# Altium schematic sheet _Power_Rail_Probe.SchDoc
size A2; SheetNumber: 1; SheetTotal: 1
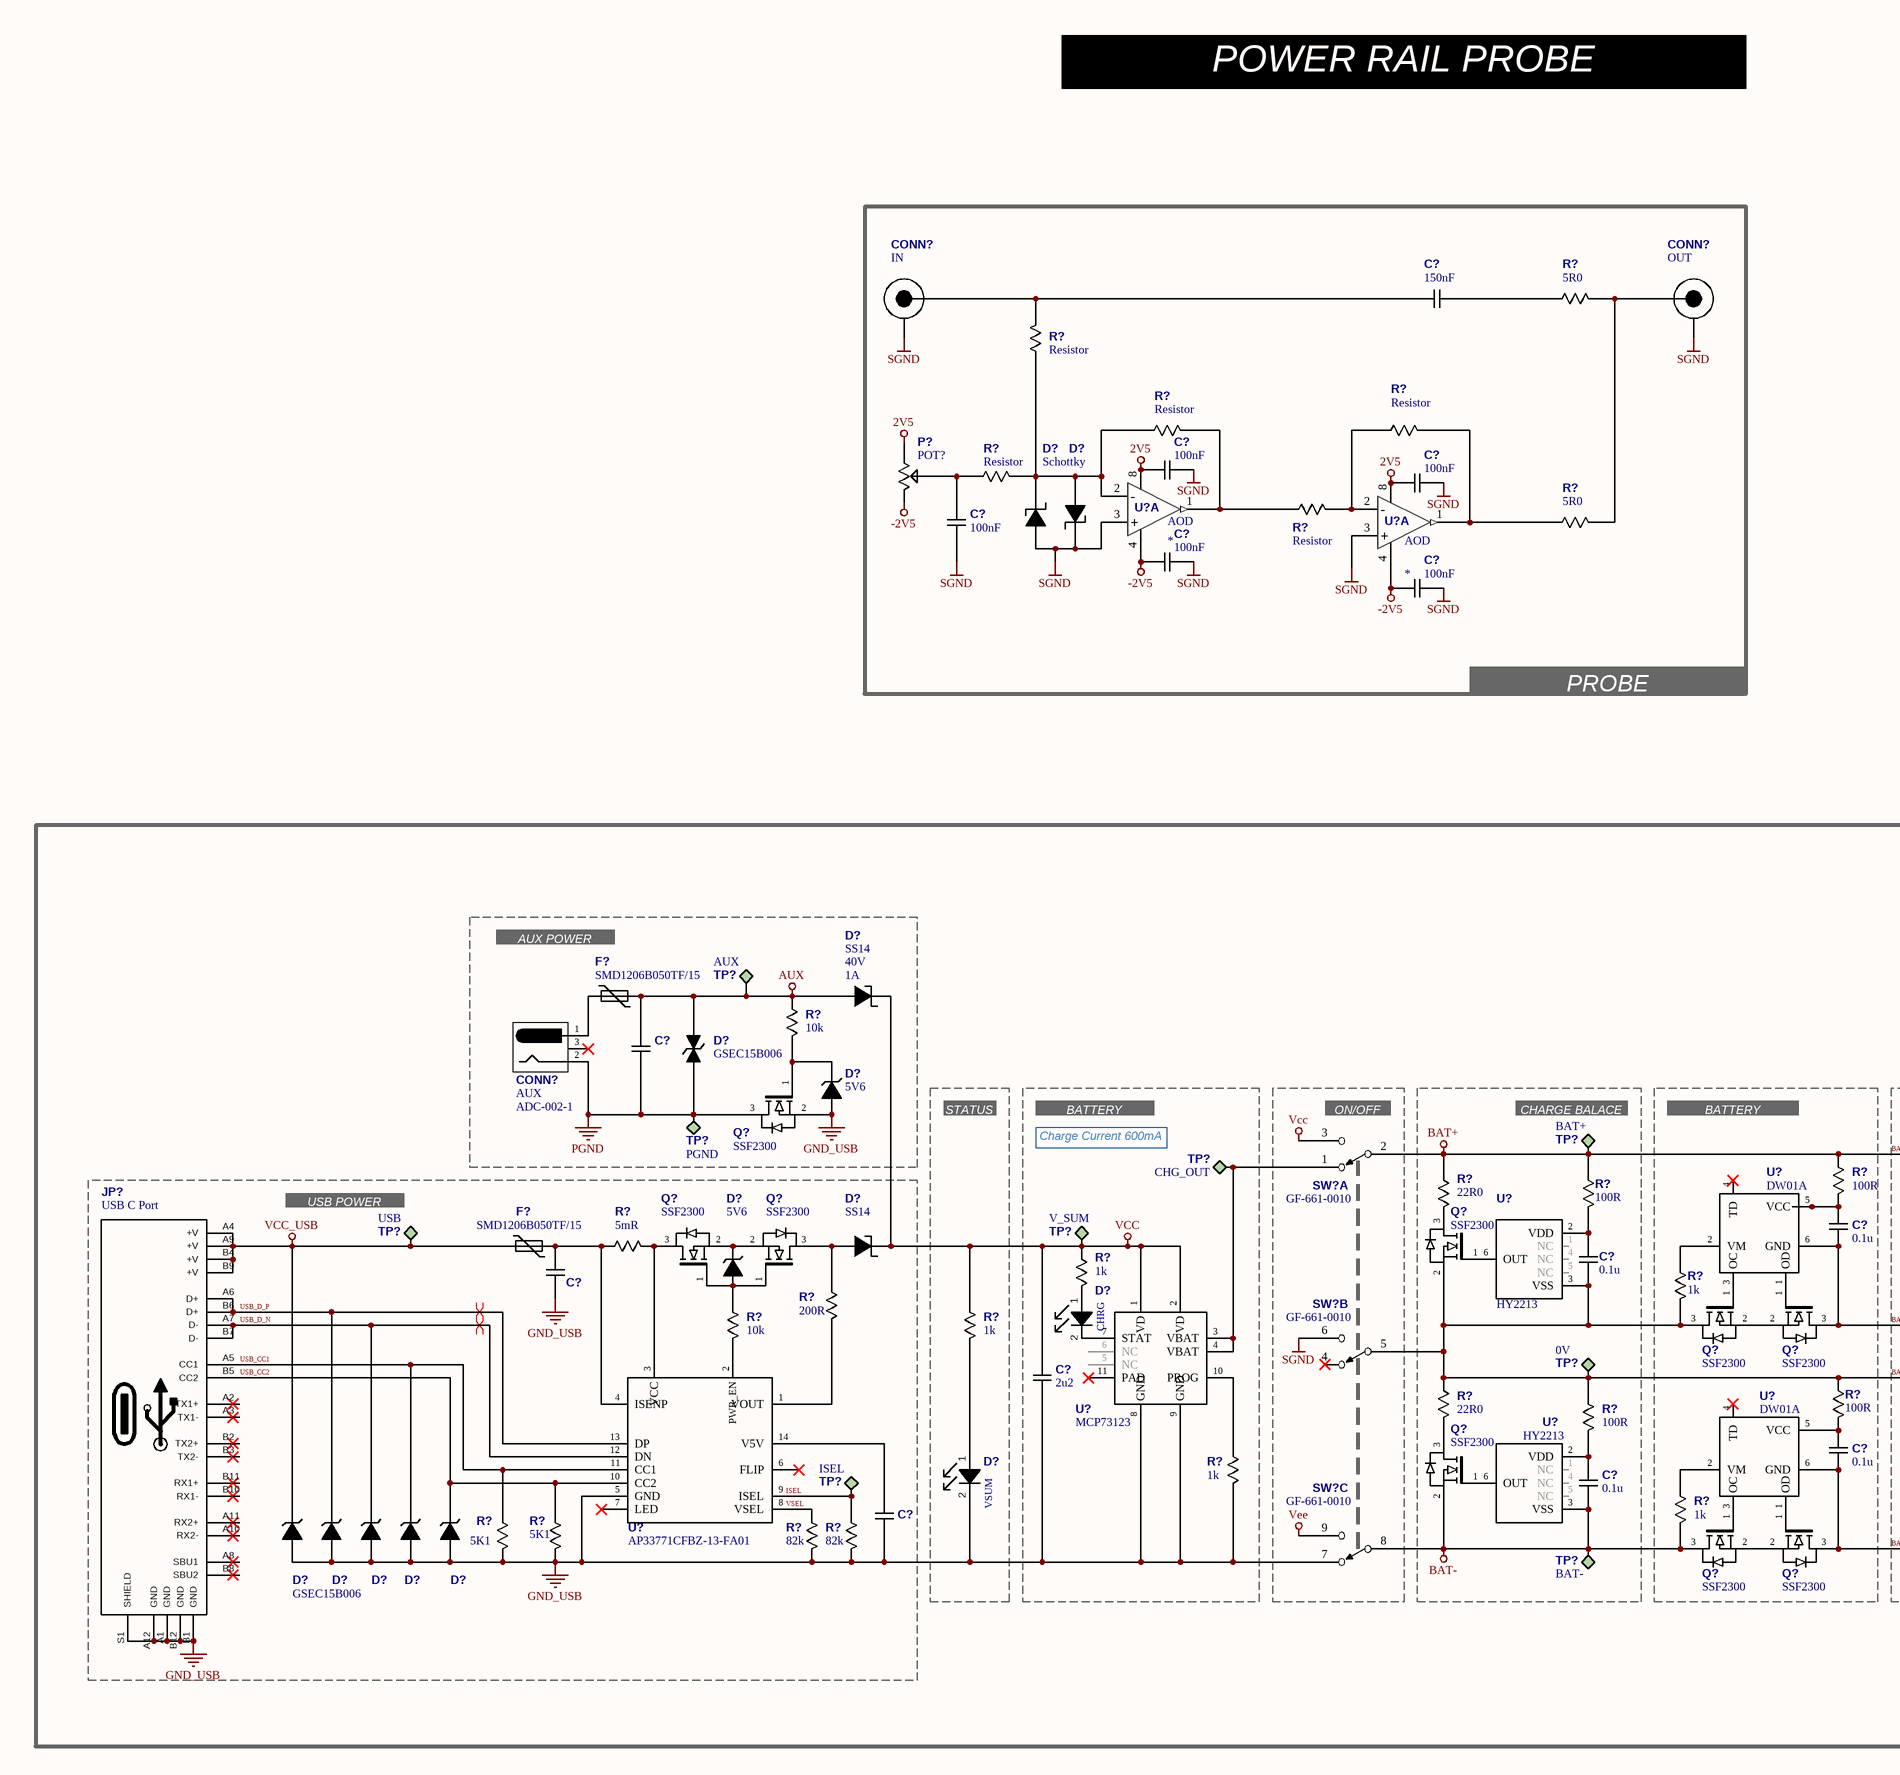
[diagram p0: _Power_Rail_Probe.SchDoc, left]
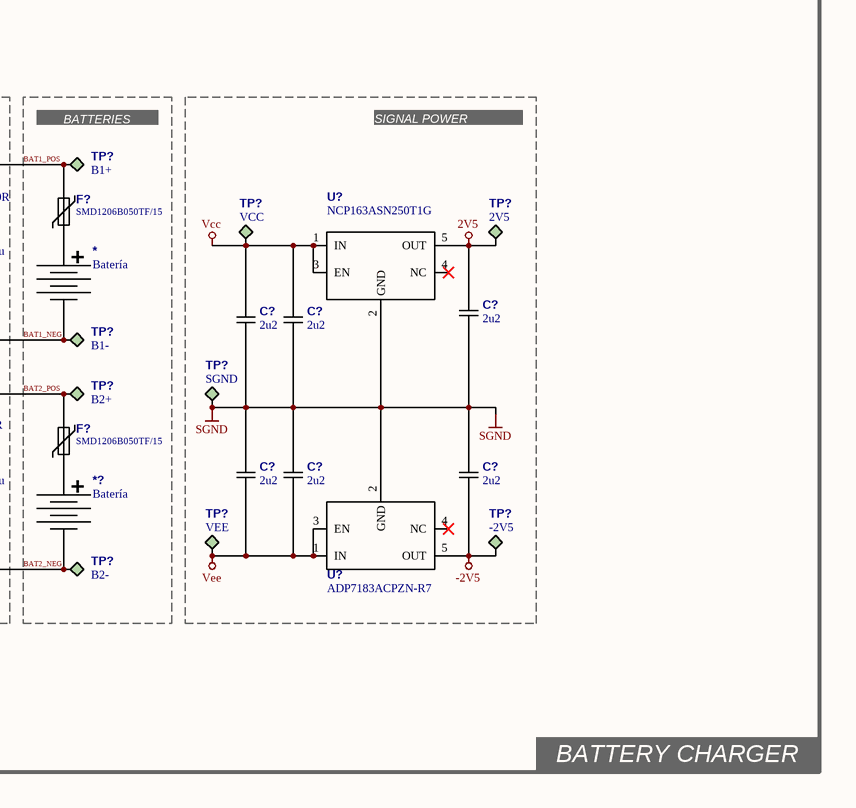
[diagram p1: _Power_Rail_Probe.SchDoc, right]

## Parts
(Parts that share a designator on the sheet are numbered #1, #2 ... from top to bottom, then left to right.)
*  Batería
*?  Batería
C?#1  150nF
C?#2  100nF
C?#3  100nF
C?#4  100nF
C?#5  100nF
C?#6  100nF
C?#7  100nF  (value not drawn)
C?#8  0.1u
C?#9  0.1u
C?#10  100nF  (value not drawn)
C?#11  2u2
C?#12  2u2
C?#13  2u2
C?#14  2u2
C?#15  0.1u
C?#16  2u2
C?#17  2u2
C?#18  2u2
C?#19  0.1u
C?#20  1u  (value not drawn)
CONN?#1  IN
CONN?#2  OUT
CONN?#3  AUX  04_Manufacturer Part Number: ADC-002-1
D?#1  Schottky  (value not drawn)
D?#2  Schottky
D?#3  SS14  07_Tensión: 40V  08_Corriente: 1A
D?#4  GSEC15B006
D?#5  5V6
D?#6  SS14
D?#7  5V6
D?#8  CHRG
D?#9  VSUM
D?#10  GSEC15B006
D?#11  GSEC15B006  (value not drawn)
D?#12  GSEC15B006  (value not drawn)
D?#13  GSEC15B006  (value not drawn)
D?#14  GSEC15B006  (value not drawn)
F?#1  SMD1206B050TF/15
F?#2  SMD1206B050TF/15
F?#3  SMD1206B050TF/15
F?#4  SMD1206B050TF/15
JP?  USB C Port
P?  POT?
Q?#1  SSF2300
Q?#2  SSF2300
Q?#3  SSF2300
Q?#4  SSF2300
Q?#5  SSF2300
Q?#6  SSF2300
Q?#7  SSF2300
Q?#8  SSF2300
Q?#9  SSF2300
R?#1  5R0
R?#2  Resistor
R?#3  Resistor
R?#4  Resistor
R?#5  Resistor
R?#6  Resistor
R?#7  5R0
R?#8  10k
R?#9  100R
R?#10  22R0
R?#11  100R
R?#12  5mR
R?#13  1k
R?#14  1k
R?#15  200R
R?#16  10k
R?#17  1k
R?#18  22R0
R?#19  100R
R?#20  100R
R?#21  1k
R?#22  1k
R?#23  5K1
R?#24  5K1
R?#25  82k
R?#26  82k
SW?#1  GF-661-0010  (part A of 3)
SW?#2  GF-661-0010  (part B of 3)
SW?#3  GF-661-0010  (part C of 3)
TP?#1  AUX  (no BOM)
TP?#2  PGND  (no BOM)
TP?#3  BAT+  (no BOM)
TP?#4  B1+  (no BOM)
TP?#5  CHG_OUT  (no BOM)
TP?#6  VCC  (no BOM)
TP?#7  2V5  (no BOM)
TP?#8  USB  (no BOM)
TP?#9  V_SUM  (no BOM)
TP?#10  B1-  (no BOM)
TP?#11  0V  (no BOM)
TP?#12  B2+  (no BOM)
TP?#13  SGND  (no BOM)
TP?#14  ISEL  (no BOM)
TP?#15  VEE  (no BOM)
TP?#16  -2V5  (no BOM)
TP?#17  BAT-  (no BOM)
TP?#18  B2-  (no BOM)
U?#1  AOD  (part A of 2)
U?#2  AOD  (part A of 2)
U?#3  DW01A
U?#4  HY2213
U?#5  NCP163ASN250T1G
U?#6  MCP73123
U?#7  AP33771CFBZ-13-FA01
U?#8  DW01A
U?#9  HY2213
U?#10  ADP7183ACPZN-R7

## Nets
2V5: C?#2.1 C?#3.1 C?#11.2 P?.1 TP?#7.1 U?#1.8(VCC) U?#2.8(VCC) U?#5.5(OUT)
-2V5: C?#5.1 C?#6.1 C?#18.1 P?.2 TP?#16.1 U?#1.4(GND) U?#2.4(GND) U?#10.5(OUT)
AUX: C?#7.2 D?#3.1(A) D?#4.2(B) F?#1.1 R?#8.2 TP?#1.1
BAT1_POS: F?#2.2 R?#9.2 R?#10.2 R?#11.2 SW?#1.2(COM1) TP?#3.1 TP?#4.1  [also labelled BAT+]
BAT-: C?#19.2 Q?#7.2(S) Q?#8.3(D) R?#22.1 SW?#3.8(COM3) TP?#17.1 U?#9.3(VSS)
GND_USB: C?#10.1 C?#14.1 C?#20.1 D?#5.6 D?#9.2(K) D?#10.6 D?#11.6 D?#12.6 D?#13.6 D?#14.6 JP?.A1(GND) JP?.A12(GND) JP?.B1(GND) JP?.B12(GND) JP?.S1(SHIELD) Q?#1.2(S) R?#21.1 R?#23.1 R?#24.1 R?#25.1 R?#26.1 SW?#3.7(NC3) U?#6.8(GND) U?#6.9(GND) U?#7.5(GND)
PGND: C?#7.1 CONN?#3.2 D?#4.1(A) Q?#1.3(D) TP?#2.1
SGND: C?#2.2 C?#3.2 C?#4.1 C?#5.2 C?#6.2 C?#11.1 C?#12.1 C?#13.1 C?#16.2 C?#17.2 C?#18.2 CONN?#1.2 CONN?#2.2 D?#1.2(K) D?#2.1(A) SW?#2.6(NO2) TP?#13.1 U?#1.3(+) U?#2.3(+) U?#5.2(GND) U?#10.2(GND)
Vcc: C?#12.2 C?#13.2 C?#14.2 D?#3.2(K) D?#6.2(K) R?#13.2 R?#17.2 SW?#1.3(NO1) TP?#6.1 TP?#9.1 U?#5.1(IN) U?#5.3(EN) U?#6.1(VD) U?#6.2(VD)
VCC_USB: D?#10.1 F?#3.2 JP?.A4(+V) JP?.A9(+V) JP?.B4(+V) JP?.B9(+V) TP?#8.1
Vee: C?#16.1 C?#17.1 SW?#3.9(NO3) TP?#15.1 U?#10.1(IN) U?#10.3(EN)
BAT1_NEG: *.4 C?#8.2 Q?#6.3(D) TP?#10.1 U?#3.6(GND)
BAT2_NEG: *?.4 C?#15.2 Q?#9.3(D) TP?#18.1 U?#8.6(GND)
BAT2_POS: C?#9.2 F?#4.2 Q?#2.2(S) Q?#5.3(D) R?#14.1 R?#18.2 R?#19.2 R?#20.2 SW?#2.5(COM2) TP?#11.1 TP?#12.1 U?#4.3(VSS)
ISEL: R?#26.2 TP?#14.1 U?#7.9(ISEL)
USB_CC1: D?#13.1 JP?.A5(CC1) R?#23.2 U?#7.11(CC1)
USB_CC2: D?#14.1 JP?.B5(CC2) R?#24.2 U?#7.10(CC2)
USB_D_N: D?#12.1 JP?.A7(D-) JP?.B7(D-) U?#7.12(DN)
USB_D_P: D?#11.1 JP?.A6(D+) JP?.B6(D+) U?#7.13(DP)
VSEL: R?#25.2 U?#7.8(VSEL)
Net*?_3: *?.3 F?#4.1
Net*_3: *.3 F?#2.1
NetC?#1_1: C?#1.1 CONN?#1.1(SIGNAL) R?#2.2
NetC?#1_2: C?#1.2 R?#1.1
NetC?#4_2: C?#4.2 P?.3 R?#5.1
NetC?#8_1: C?#8.1 R?#9.1 U?#3.5(VCC)
NetC?#9_1: C?#9.1 R?#11.1 U?#4.2(VDD)
NetC?#10_2: C?#10.2 F?#3.1 R?#12.2 U?#7.4(ISENP)
NetC?#15_1: C?#15.1 R?#19.1 U?#8.5(VCC)
NetC?#19_1: C?#19.1 R?#20.1 U?#9.2(VDD)
NetC?#20_2: C?#20.2 U?#7.14(V5V)
NetCONN?#2_1: CONN?#2.1(SIGNAL) R?#1.2 R?#7.2
NetCONN?#3_1: CONN?#3.1(SIGNAL) F?#1.2
NetD?#1_1: D?#1.1(A) D?#2.2(K) R?#2.1 R?#3.1 R?#5.2 U?#1.2(-)
NetD?#5_1: D?#5.1 Q?#1.1(G) R?#8.1
NetD?#6_1: D?#6.1(A) Q?#4.3(D) R?#15.2
NetD?#7_1: D?#7.1 Q?#3.2(S) Q?#4.2(S)
NetD?#7_6: D?#7.6 Q?#3.1(G) Q?#4.1(G) R?#16.2
NetD?#8_1: D?#8.1(A) R?#13.1
NetD?#8_2: D?#8.2(K) U?#6.7(STAT)
NetD?#9_1: D?#9.1(A) R?#17.1
NetQ?#2_1: Q?#2.1(G) U?#4.6(OUT)
NetQ?#2_3: Q?#2.3(D) R?#10.1
NetQ?#3_3: Q?#3.3(D) R?#12.1 U?#7.3(VCC)
NetQ?#5_1: Q?#5.1(G) U?#3.3(OC)
NetQ?#5_2: Q?#5.2(S) Q?#6.2(S)
NetQ?#6_1: Q?#6.1(G) U?#3.1(OD)
NetQ?#7_1: Q?#7.1(G) U?#9.6(OUT)
NetQ?#7_3: Q?#7.3(D) R?#18.1
NetQ?#8_1: Q?#8.1(G) U?#8.3(OC)
NetQ?#8_2: Q?#8.2(S) Q?#9.2(S)
NetQ?#9_1: Q?#9.1(G) U?#8.1(OD)
NetR?#3_2: R?#3.2 R?#6.1 U?#1.1(OUT)
NetR?#4_1: R?#4.1 R?#6.2 U?#2.2(-)
NetR?#4_2: R?#4.2 R?#7.1 U?#2.1(OUT)
NetR?#14_2: R?#14.2 U?#3.2(VM)
NetR?#15_1: R?#15.1 U?#7.1(VOUT)
NetR?#16_1: R?#16.1 U?#7.2(PWR_EN)
NetR?#21_2: R?#21.2 U?#6.10(PROG)
NetR?#22_2: R?#22.2 U?#8.2(VM)
NetSW?#1_1: SW?#1.1(NC1) TP?#5.1 U?#6.3(VBAT) U?#6.4(VBAT)

Not connected (* = marked no-connect by the designer): CONN?#3 3*; JP? A2(TX1+)* A3(TX1-)* A8(SBU1)* A10(RX2-)* A11(RX2+)* B2(TX2+)* B3(TX2-)* B8(SBU2)* B10(RX1-)* B11(RX1+)*; SW?#2 4(NC2)*; U?#3 4(TD)*; U?#4 1(NC) 4(NC) 5(NC); U?#5 4(NC)*; U?#6 5(NC) 6(NC) 11(PAD)*; U?#7 6(FLIP)* 7(LED)*; U?#8 4(TD)*; U?#9 1(NC) 4(NC) 5(NC); U?#10 4(NC)*

## Layout directives
differential pair: USB_D_N, USB_D_P

## Notes on the sheet
- POWER RAIL PROBE
- PROBE
- AUX POWER
- STATUS
- BATTERY CHARGER
- (near SW?#1) ON/OFF
- (near TP?#3) CHARGE BALACE
- BATTERY PROTECTION
- (near TP?#4) BATTERIES
- SIGNAL POWER SUPPLIES
- Charge Current 600mA
- (near TP?#8) USB POWER
- (in symbol Batería) +

## Library data of the parts
C?#1-C?#20 = Capacitor NP: 01_Componente: Capacitor cerámico; 02_Montaje: SMD; 04_Manufacturer Part Number: *; 05_Digikey Part Number: *; ComponentLink1Description: A_Datasheet; ComponentLink1URL: *; 06_Manufacturer: *; ComponentLink2Description: B_Digikey; ComponentLink2URL: *; 07_Valor: *; 08_Tolerancia: *; 09_Tensión de trabajo: *; 10_Dielectrico: *
CONN?#1 CONN?#2 = Conector BNC: BNC Connector Jack, Female Socket 50 Ohms Panel Mount, Through Hole, Right Angle Solder; 04_Manufacturer Part Number: CONBNC002; 06_Manufacturer: TE Connectivity Linx; 02_Montaje: SMD; 07_Contactos: 2; 08_Impedancia: 50 Ohm; 01_Componente: Conector BNC; 03_Encapsulado: BNC; 05_Digikey Part Number: 343-CONBNC002-ND; ComponentLink1Description: A_Datasheet; ComponentLink2Description: B_Digikey
  CONN?#1: ComponentLink1URL: https://www.te.com/commerce/DocumentDelivery/DDEController?Action=srchrtrv&DocNm=CONBNC002&DocType=Data+Sheet&DocLang=English&DocFormat=pdf&PartCntxt=CONBNC002; ComponentLink2URL: https://www.digikey.com/en/products/detail/te-connectivity-linx/CONBNC002/16013841
  CONN?#2: ComponentLink1URL: *; ComponentLink2URL: *
CONN?#3 = DC JACK: 06_Manufacturer: Adam Tech; 02_Montaje: THT; 07_Contactos: 3; 01_Componente: DC JACK; 03_Encapsulado: -; 05_Digikey Part Number: 2057-ADC-002-1-ND; ComponentLink1Description: A_Datasheet; ComponentLink1URL: https://app.adam-tech.com/products/download/data_sheet/203725/adc-002-x-data-sheet.pdf; ComponentLink2Description: B_Digikey; ComponentLink2URL: https://www.digikey.com/en/products/detail/adam-tech/ADC-002-1/21710741; 08_Paso: -
D?#1 D?#2 = Diodo Schottky: 01_Componente: Diodo Zener; 02_Montaje: SMD; 04_Manufacturer Part Number: *; 05_Digikey Part Number: *; ComponentLink1Description: A_Datasheet; ComponentLink1URL: *; 06_Manufacturer: *; ComponentLink2Description: B_Digikey; ComponentLink2URL: *; 07_Tensión: *; 08_Corriente: *
D?#3 = Diodo Schottky: 04_Manufacturer Part Number: SS14-M3/5AT; 06_Manufacturer: Vishay General Semiconductor - Diodes Division; 02_Montaje: SMD; 03_Encapsulado: DO-214AC; 01_Componente: Diodo Schottky; 05_Digikey Part Number: SS14-M3/5ATGICT-ND; ComponentLink1Description: A_Datasheet; ComponentLink1URL: https://mm.digikey.com/Volume0/opasdata/d220001/medias/docus/661/SS12-SS16.pdf; ComponentLink2Description: B_Digikey; ComponentLink2URL: https://www.digikey.com/en/products/detail/vishay-general-semiconductor-diodes-division/SS14-M3-5AT/4872626?s=N4IgTCBcDaIMpwIwBYC0BZAzAegKwEEAVEAXQF8g
D?#4 = Diodo TVS Bidireccional: Diodo TVS; 06_Manufacturer: Good-Ark Semiconductor; 02_Montaje: SMD; 03_Encapsulado: SOD-323; 07_Tensión de trabajo: 15V; 01_Componente: Diodo TVS; 04_Manufacturer Part Number: GSEC15B006; 05_Digikey Part Number: 4786-GSEC15B006CT-ND; ComponentLink1Description: A_Datasheet; ComponentLink1URL: *; ComponentLink2Description: B_Digikey; ComponentLink2URL: *
D?#5 D?#7 = Diodo Zener: 04_Manufacturer Part Number: BZT52C5V6S-7-F; 06_Manufacturer: Diodes Incorporated; 02_Montaje: SMD; 03_Encapsulado: SOD-323; 01_Componente: Diodo Zener; 05_Digikey Part Number: BZT52C5V6S-FDICT-ND; ComponentLink1Description: A_Datasheet; ComponentLink2Description: B_Digikey; 07_Tensión de trabajo: 5V6
  D?#5: ComponentLink1URL: https://mm.digikey.com/Volume0/opasdata/d220001/medias/docus/804/BZT52C2V0S-BZT52C39S.pdf; ComponentLink2URL: https://www.digikey.com/en/products/detail/diodes-incorporated/BZT52C5V6S-7-F/804868
  D?#7: ComponentLink1URL: *; ComponentLink2URL: *
D?#6 = Diodo Schottky: 04_Manufacturer Part Number: SS14-M3/5AT; 06_Manufacturer: Vishay General Semiconductor - Diodes Division; 02_Montaje: SMD; 03_Encapsulado: DO-214AC; 07_Tensión: 40V; 08_Corriente: 1A; 01_Componente: Diodo Schottky; 05_Digikey Part Number: SS14-M3/5ATGICT-ND; ComponentLink1Description: A_Datasheet; ComponentLink1URL: *; ComponentLink2Description: B_Digikey; ComponentLink2URL: *
D?#8 D?#9 = Diodo LED: 04_Manufacturer Part Number: SML-D12U1WT86; 06_Manufacturer: Rohm Semiconductor; 02_Montaje: SMD; 03_Encapsulado: 1608; 01_Componente: Diodo Led; 05_Digikey Part Number: SML-D12U1WT86CT-ND; ComponentLink1Description: A_Datasheet; ComponentLink1URL: https://www.rohm.com/datasheet?p=SML-D12U1W&dist=Digi-key&media=referral&source=digi-key.com&campaign=Digi-key; ComponentLink2Description: B_Digikey; ComponentLink2URL: https://www.digikey.com/en/products/detail/rohm-semiconductor/SML-D12U1WT86/5843853
D?#10-D?#14 = Diodo TVS Unidireccional: Diodo TVS; 06_Manufacturer: Good-Ark Semiconductor; 02_Montaje: SMD; 03_Encapsulado: SOD-323; 07_Tensión de trabajo: 15V; 01_Componente: Diodo TVS; 04_Manufacturer Part Number: GSEC15B006; 05_Digikey Part Number: 4786-GSEC15B006CT-ND; ComponentLink1Description: A_Datasheet; ComponentLink2Description: B_Digikey
  D?#10-D?#13: ComponentLink1URL: *; ComponentLink2URL: *
  D?#14: ComponentLink1URL: https://goodarksemi.com/docs/datasheets/esd_tvs/GSECxB006.pdf; ComponentLink2URL: https://www.digikey.com/en/products/detail/good-ark-semiconductor/GSEC15B006/18667511
F?#1-F?#4 = Polyswitch: Polymeric PTC Resettable Fuse 15V 500 mA Ih Surface Mount 1206 (3216 Metric), Concave; 06_Manufacturer: YAGEO; 02_Montaje: Through Hole; 03_Encapsulado: 1206; 07_Valor: 500mA; 01_Componente: Polyswitch; 04_Manufacturer Part Number: SMD1206B050TF/15; 05_Digikey Part Number: 13-SMD1206B050TF/15CT-ND; ComponentLink1Description: A_Datasheet; ComponentLink2Description: B_Digikey
  F?#1 F?#3 F?#4: ComponentLink1URL: https://www.yageogroup.com/content/datasheet/asset/file/SMD1210_1; ComponentLink2URL: https://www.digikey.com/en/products/detail/yageo/SMD1210B075TF-24/15212934
  F?#2: ComponentLink1URL: https://www.yageo.com/upload/media/product/productsearch/datasheet/cpc/pptc/SMD1206_1.pdf; ComponentLink2URL: https://www.digikey.com/en/products/detail/yageo/SMD1206B050TF-15/13689651
JP? = USB C 3.0: 01_Componente: Conector USB C; 02_Montaje: SMD; 07_Contactos: 12; 04_Manufacturer Part Number: *; 05_Digikey Part Number: *; ComponentLink1Description: A_Datasheet; ComponentLink1URL: *; 06_Manufacturer: *; ComponentLink2Description: B_Digikey; ComponentLink2URL: *; 08_Paso: *
P? = POTENCIÓMETRO: 01_Componente: Potenciometer; 02_Montaje: THT; 04_Manufacturer Part Number: *; 05_Digikey Part Number: *; ComponentLink1Description: A_Datasheet; ComponentLink1URL: *; 06_Manufacturer: *; ComponentLink2Description: B_Digikey; ComponentLink2URL: *; 07_Valor: *; 08_Tolerancia: *
Q?#1-Q?#9 = NMOS: N-Channel MOSFET SOT-23; 04_Manufacturer Part Number: AO3414A; 06_Manufacturer: UMW; 02_Montaje: SMD; 07_Tensión máxima: 20V; 08_Corriente máxima: 4.5A; 09_Potencia máxima: 1.3W; 01_Componente: NMOS; 03_Encapsulado: SOT-23; 05_Digikey Part Number: 4518-AO3414ACT-ND; ComponentLink1Description: A_Datasheet; ComponentLink2Description: B_Digikey
  Q?#1: ComponentLink1URL: https://mm.digikey.com/Volume0/opasdata/d220001/medias/docus/5022/AO3414A.pdf; ComponentLink2URL: https://www.digikey.com/en/products/detail/umw/AO3414A/17635259
  Q?#6: ComponentLink1URL: https://goodarksemi.com/docs/datasheets/mosfets/SSF2300.pdf; ComponentLink2URL: https://www.digikey.com/en/products/detail/good-ark-semiconductor/SSF2300/18648256
R?#1-R?#14 R?#16-R?#26 = Resistor: 02_Montaje: SMD; 01_Componente: Resistor; 04_Manufacturer Part Number: *; 05_Digikey Part Number: *; ComponentLink1Description: A_Datasheet; ComponentLink1URL: *; 06_Manufacturer: *; ComponentLink2Description: B_Digikey; ComponentLink2URL: *; 07_Valor: *; 08_Tolerancia: *
R?#15 = Resistor: 04_Manufacturer Part Number: SS14-M3/5AT; 06_Manufacturer: Vishay General Semiconductor - Diodes Division; 02_Montaje: SMD; 03_Encapsulado: DO-214AC; 01_Componente: Resistor; 05_Digikey Part Number: SS14-M3/5ATGICT-ND; ComponentLink1Description: A_Datasheet; ComponentLink1URL: https://mm.digikey.com/Volume0/opasdata/d220001/medias/docus/661/SS12-SS16.pdf; ComponentLink2Description: B_Digikey; ComponentLink2URL: https://www.digikey.com/en/products/detail/vishay-general-semiconductor-diodes-division/SS14-M3-5AT/4872626; 07_Valor: *; 08_Tolerancia: *
SW?#1-SW?#3 = Interruptor 3PDT: Slide Switch 3PDT Through Hole; 06_Manufacturer: CW Industries; 02_Montaje: THT; 03_Encapsulado: NA; 01_Componente: Switch; 04_Manufacturer Part Number: GF-661-0010; 05_Digikey Part Number: GF-661-0010-ND; ComponentLink1Description: 01_Digikey; ComponentLink1URL: https://www.digikey.com/en/products/detail/cw-industries/GF-661-0010/2771205; ComponentLink2Description: 02_Datasheet; ComponentLink2URL: https://www.cwind.com/sites/cwind/files/2018-04/Miniature%20Slide%20Switches.pdf
TP?#1-TP?#18 = TestPoint_SMD: Testpoint; 01_Componente: Trimpot; 02_Montaje: SMD; 03_Encapsulado: NA; 04_Manufacturer Part Number: NA; 05_Digikey Part Number: NA; ComponentLink1Description: A_Datasheet; ComponentLink1URL: NA; ComponentLink2Description: B_Digikey; ComponentLink2URL: NA
U?#1 U?#2 = Amplificador Operacional Doble: 02_Montaje: SMD; 03_Encapsulado: SOIC_8; 01_Componente: Amplificador operacional doble; 04_Manufacturer Part Number: *; 05_Digikey Part Number: *; ComponentLink1Description: A_Datasheet; ComponentLink1URL: *; Parameter 1: *; ComponentLink2Description: B_Digikey; ComponentLink2URL: *
U?#3 U?#8 = DW01A: 1S Battery Protection IC
U?#4 U?#9 = HY2213: Battery Charge Balance IC
U?#5 = NCP163ASN250T1G: LDO Fixed 2V5 250mA Ultra-Low Noise SOT-23-5; 06_Manufacturer: Texas Instruments; 02_Montaje: SMD; 03_Encapsulado: SOT_23-5; 07_Tensión nominal: 3V3; 08_Corriente de salida: 300 mA; 09_Potencia de salida: 1W; 01_Componente: LDO; 04_Manufacturer Part Number: NCP163ASN250T1G; 05_Digikey Part Number: 488-NCP163ASN250T1GCT-ND; ComponentLink1Description: A_Datasheet; ComponentLink1URL: https://www.onsemi.com/pdf/datasheet/ncp163-d.pdf; ComponentLink2Description: B_Digikey; ComponentLink2URL: https://www.digikey.com/es/products/detail/onsemi/NCP163ASN250T1G/9694659
U?#6 = MCP73123: Battery Charger IC; 04_Manufacturer Part Number: MCP73213T-A6SI/MF; 06_Manufacturer: Microchip Technology; 01_Componente: Cargador de batería; 02_Montaje: SMD; 03_Encapsulado: DFN-10; 05_Digikey Part Number: MCP73213T-A6SI/MFCT-ND; ComponentLink1Description: Datasheet; ComponentLink1URL: https://ww1.microchip.com/downloads/en/DeviceDoc/30009610F.pdf; ComponentLink2Description: Digikey; ComponentLink2URL: https://www.digikey.com/en/products/detail/microchip-technology/MCP73213T-A6SI-MF/2126117
U?#7 = AP33771C: Battery Charger IC; 06_Manufacturer: Microchip Technology; 01_Componente: Cargador de batería; 02_Montaje: SMD; 03_Encapsulado: W-DFN3030-14; 04_Manufacturer Part Number: AP33771CFBZ-13-FA01; 05_Digikey Part Number: 31-AP33771CFBZ-13-FA01CT-ND; ComponentLink1Description: Datasheet; ComponentLink1URL: https://www.diodes.com/datasheet/download/AP33771C.pdf; ComponentLink2Description: Digikey; ComponentLink2URL: https://www.digikey.com/en/products/detail/diodes-incorporated/AP33771CFBZ-13-FA01/24384228?s=N4IgjCBcpgnAHLKoDGUBmBDANgZwKYA0IA9lANogAMIAugL7EC0ArMiGpFnkaRSACY69RoP4BBAAoBmaQHY5EWsQBs7AJYATKCCZgqEYgAcALjpDETATyP4dmXGhFA
U?#10 = ADP7183ACPZN-R7: LDO Fixed -2V5 250mA Ultra-Low Noise SOT-23-5; 06_Manufacturer: Texas Instruments; 02_Montaje: SMD; 03_Encapsulado: SOT_23-5; 07_Tensión nominal: 3V3; 08_Corriente de salida: 300 mA; 09_Potencia de salida: 1W; 01_Componente: LDO; 04_Manufacturer Part Number: ADP7183ACPZN-R7; 05_Digikey Part Number: 505-ADP7183ACPZN-R7CT-ND; ComponentLink1Description: A_Datasheet; ComponentLink1URL: https://www.onsemi.com/pdf/datasheet/ncp163-d.pdf; ComponentLink2Description: B_Digikey; ComponentLink2URL: https://www.analog.com/media/en/technical-documentation/data-sheets/ADP7183.pdf